# Altium schematic sheet CAN-Driver.SchDoc: Driver CAN
size Letter; ApprovedBy: APPROUVÉ PAR; Organization: Cegep Limoilou; Address1: 1300, 8e Avenue; Address2: Québec, QC; Address3: Canada; Address4: G1J 5L5; SheetNumber: 6; SheetTotal: 7
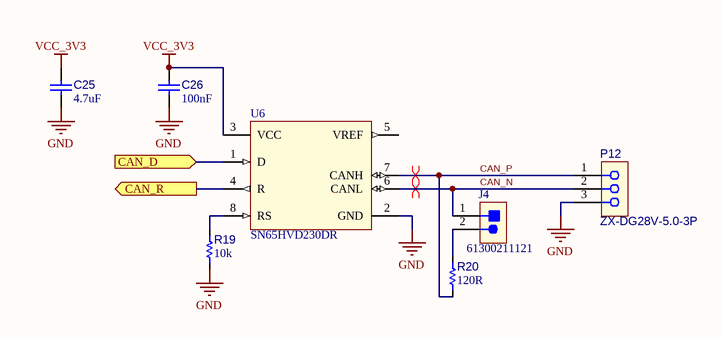
[diagram p0: CAN-Driver.SchDoc]

## Parts
C25  value 4.7uF  [C_2012[0805]]  (hidden comment: Cap 4.7uF 0805)
C26  value 100nF  [C_1005[0402]]  (hidden comment: Cap 100nF 0402)
J4  61300211121  [CONN_HDR_2POS_100MILS_TH]
P12  ZX-DG28V-5.0-3P  [CONN_TERM_BLOCK_3POS_5mm_Model1]  (no BOM)
R19  value 10k  [R_1005[0402]]  (hidden comment: Res 10k 1% 0402)
R20  value 120R  [R_3216[1206]]  (hidden comment: Res 120R 1206)
U6  SN65HVD230DR  [SOIC-8]

## Ports
CAN_D (in, see PCB-Support-STM32F407[3C]), CAN_R (out, see PCB-Support-STM32F407[3C])

## Nets
GND: C25.1 C26.1 P12.3 R19.1 U6.2(GND)
VCC_3V3: C25.2 C26.2 U6.3(VCC)
CAN_D: U6.1(D) ; port CAN_D
CAN_N: J4.1 P12.2 U6.6(CANL)
CAN_P: P12.1 R20.1 U6.7(CANH)
CAN_R: U6.4(R) ; port CAN_R
NetJ4_2: J4.2 R20.2
NetR19_2: R19.2 U6.8(RS)

Not connected (* = marked no-connect by the designer): U6 5(VREF)

## Layout directives
differential pair: CAN_N, CAN_P

## Notes on the sheet
- Titre :
- Conception :
- Date :
- Approbation :
- Heure :
- Révision :
- Feuille
- de
- Fichier :

## Library data of the parts
C25 = CAP003: Capacitor type 1; Manufacturer 1: Taiyo Yuden; Manufacturer Part Number 1: TMK212AB7475KG-T; LibRef: CAP003; CEGEP: KCOND02SM; Tolerance: 10%; Rated Voltage: 25V; Dielectric: X7R; Supplier 1: LCSC; Supplier Part Number 1: C163186; Mounting Technology: SMT
C26 = CAP001: Capacitor type 1; Manufacturer 1: Taiyo Yuden; Manufacturer Part Number 1: UMK105B7104KV-FR; LibRef: CAP001; CEGEP: KCOND01SM; Tolerance: 10%; Rated Voltage: 50V; Dielectric: X7R; Mounting Technology: SMT; Supplier 1: LCSC; Supplier Part Number 1: C2167491
J4 = CONN-100MIL-HDR-01X02: CONN HEADER 2POS 100MIL; Manufacturer 1: Megastar; Manufacturer Part Number 1: ZX-PZ2.54-1-2PZZ; Value: R120; Mounting Technology: TH; Supplier 1: LCSC; Supplier Part Number 1: C7501260; Manufacturer 2: Würth Elektronik; Manufacturer Part Number 2: 61300211121
P12 = CONN-5MM-3POS-TERM-BLOCK: CONN TERM BLOCK 3POS 5mm pitch; Manufacturer 1: Megastar; Value: CAN; Code CEGEP: CONWECO0003; Supplier 1: LCSC; Supplier Part Number 1: ZX-DG28V-5.0-3P; Manufacturer Part Number 1: ZX-DG28V-5.0-3P; Mounting Technology: TH; Manufacturer 2: Weco - Phoenix Contact; Manufacturer Part Number 2: 950-DS/03 - 1890976
R19 = RES003: Resistor type 1; Manufacturer 1: Vishay; Manufacturer Part Number 1: CR0402F1002T1LF; LibRef: RES003; Puissance: 1/16W; Max Working Voltage: 50V; Tolerance: 1%; Mounting Technology: SMT; Supplier 1: Digikey; Supplier Part Number 1: 541-10.0KLCT-ND
R20 = RES014: Resistor type 1; Manufacturer 1: Yageo; Manufacturer Part Number 1: RC1206FR-07120RL; LibRef: RES014; CEGEP: RESI0043SMT; Tolerance: 1%; Puissance: 1/4W; Max Working Voltage: 200V; Mounting Technology: SMT; Supplier 1: LCSC; Supplier Part Number 1: C114928; Supplier 2: Digikey; Supplier Part Number 2: P120ECT-ND
U6 = U_SN65HVD230DR: IC TRANSCEIVER HALF 1/1 8SOIC; Manufacturer 1: TI; Manufacturer Part Number 1: SN65HVD230DR; Mounting Technology: SMT; Supplier 1: LCSC; Supplier Part Number 1: C12084